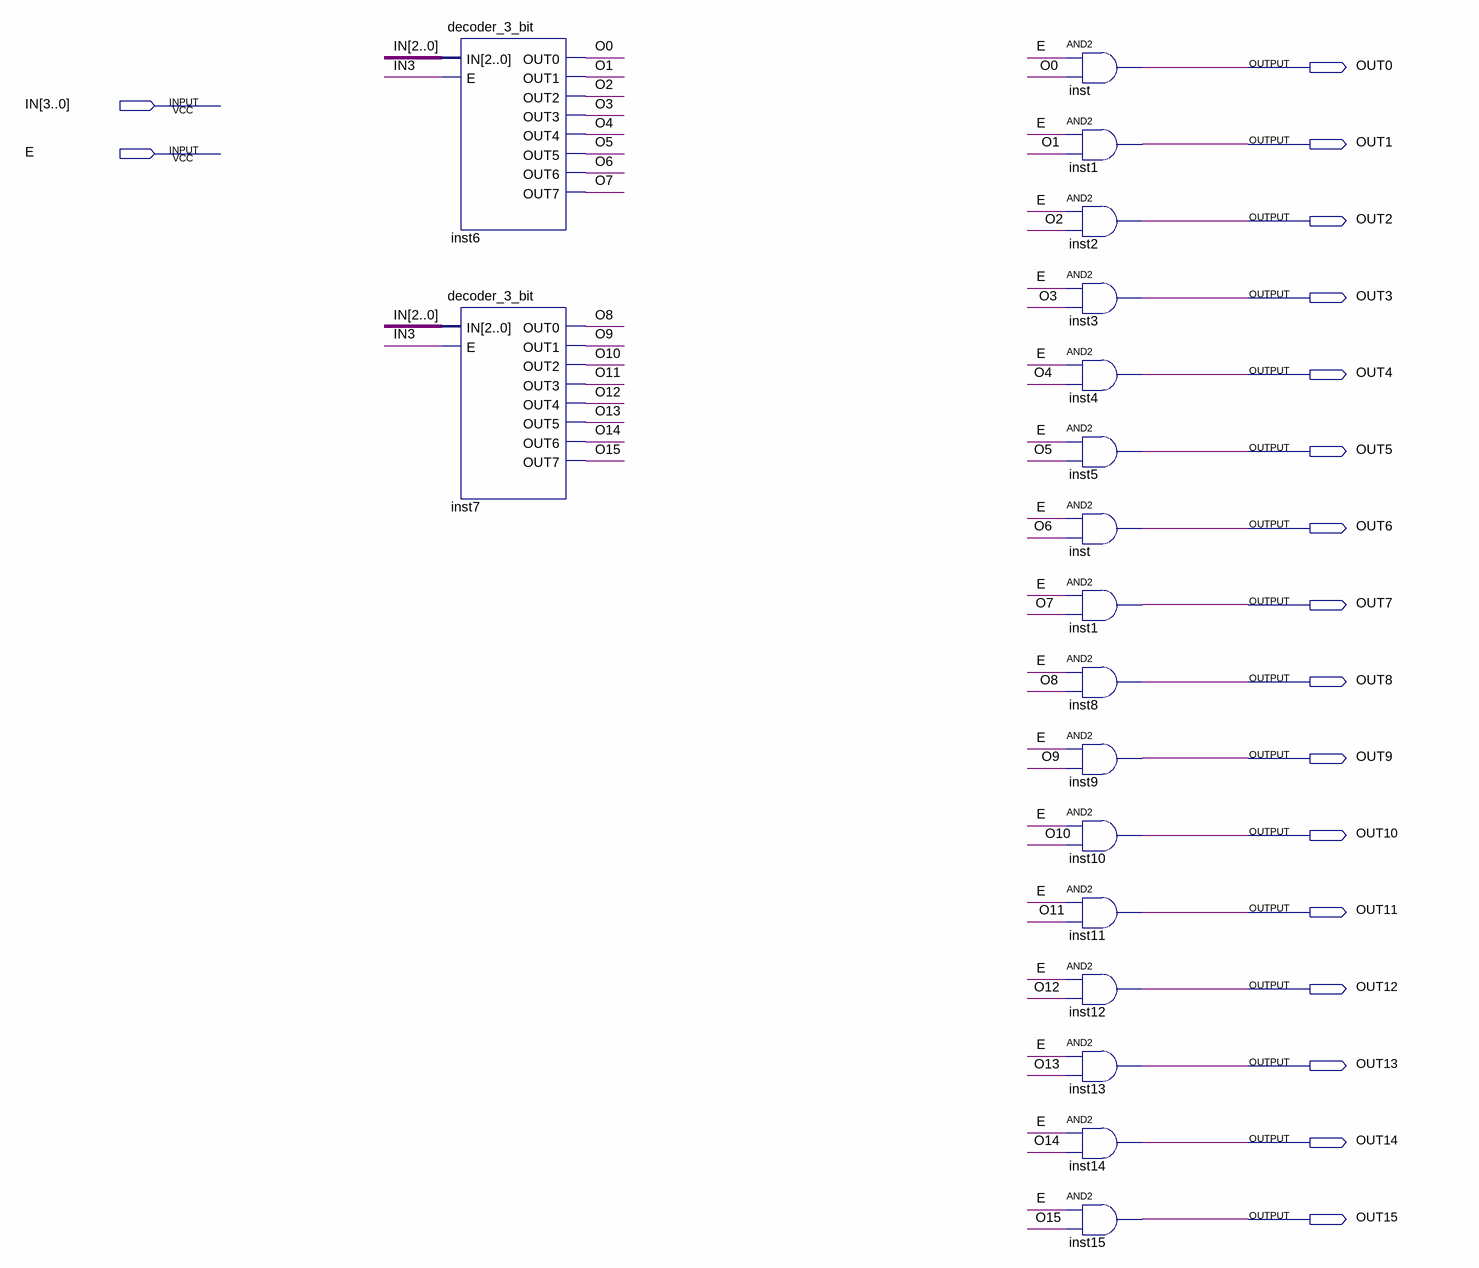
[diagram p0: schematic sheet]
// Quartus schematic decoder_4_bit.bdf as structural Verilog: 18 symbols, 18 pins
module decoder_4_bit (
  input  [3:0] IN,
  input  E,
  output OUT0,
  output OUT1,
  output OUT2,
  output OUT3,
  output OUT4,
  output OUT5,
  output OUT6,
  output OUT7,
  output OUT8,
  output OUT9,
  output OUT10,
  output OUT11,
  output OUT12,
  output OUT13,
  output OUT14,
  output OUT15
);

  wire O0, O1, O2, O3, O4, O5, O6, O7, O8, O9, O10, O11, O12, O13, O14, O15;

  decoder_3_bit inst6 (
    .IN(IN[2:0]), .E(IN[3]), .OUT0(O0), .OUT1(O1), .OUT2(O2), .OUT3(O3), .OUT4(O4), .OUT5(O5), .OUT6(O6),
    .OUT7(O7));
  decoder_3_bit inst7 (
    .IN(IN[2:0]), .E(IN[3]), .OUT0(O8), .OUT1(O9), .OUT2(O10), .OUT3(O11), .OUT4(O12), .OUT5(O13),
    .OUT6(O14), .OUT7(O15));
  and inst (OUT0, E, O0);
  and inst1 (OUT1, E, O1);
  and inst2 (OUT2, E, O2);
  and inst3 (OUT3, E, O3);
  and inst4 (OUT4, E, O4);
  and inst5 (OUT5, E, O5);
  and inst_dup2 (OUT6, E, O6);
  and inst1_dup2 (OUT7, E, O7);
  and inst8 (OUT8, E, O8);
  and inst9 (OUT9, E, O9);
  and inst10 (OUT10, E, O10);
  and inst11 (OUT11, E, O11);
  and inst12 (OUT12, E, O12);
  and inst13 (OUT13, E, O13);
  and inst14 (OUT14, E, O14);
  and inst15 (OUT15, E, O15);
endmodule
